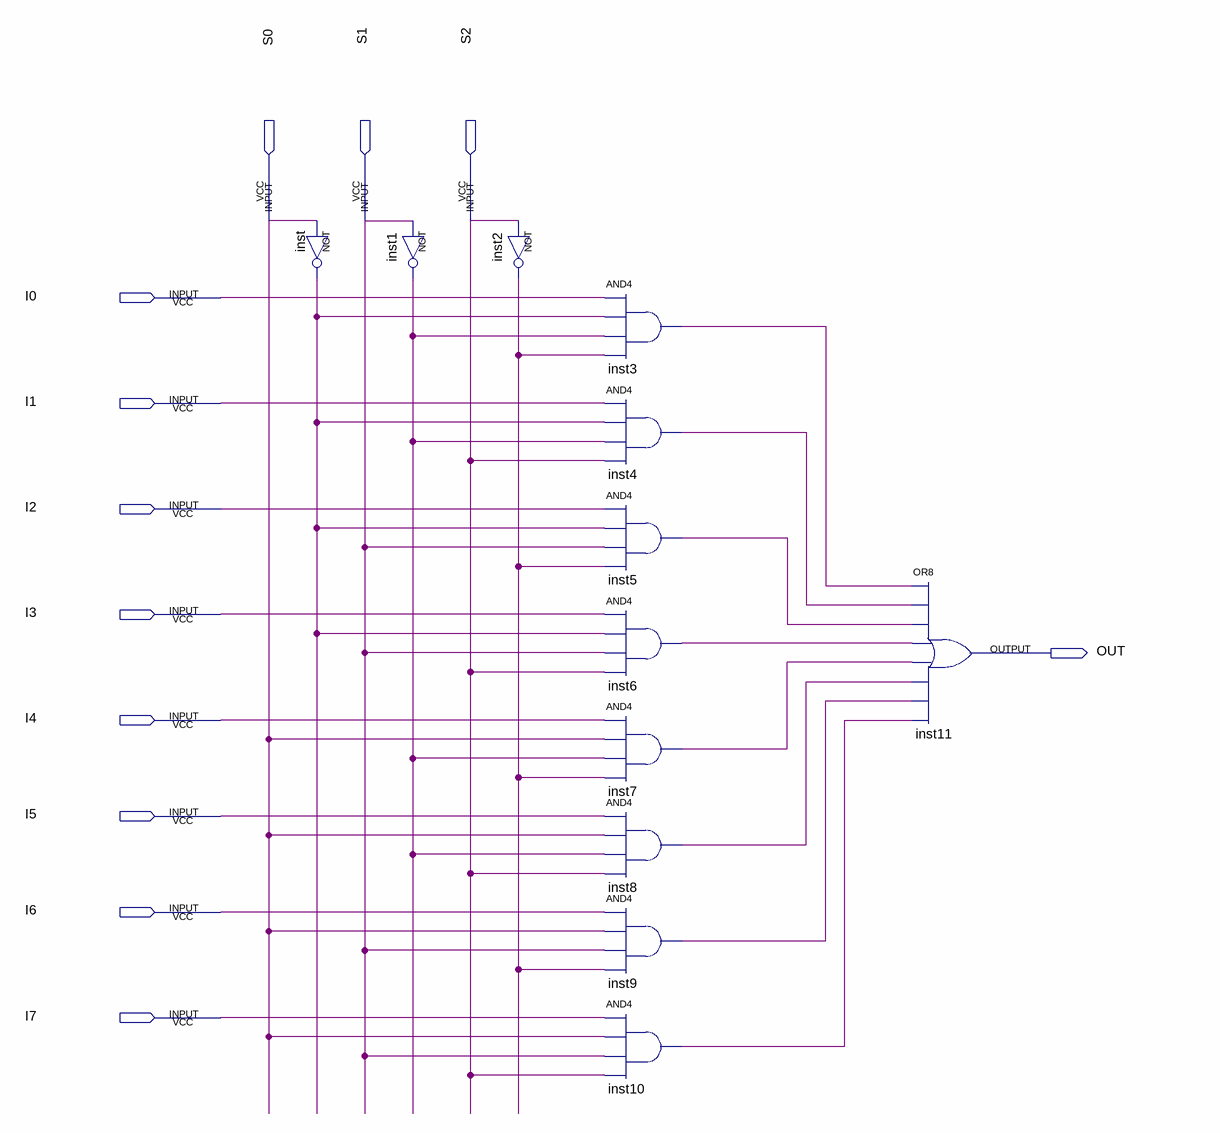
[diagram p0: schematic sheet]
// Quartus schematic MUX8x1.bdf as structural Verilog: 12 symbols, 12 pins
module MUX8x1 (
  input  S0,
  input  S1,
  input  S2,
  input  I0,
  input  I1,
  input  I2,
  input  I3,
  input  I4,
  input  I5,
  input  I6,
  input  I7,
  output OUT
);

  wire inst1_out, inst2_out, inst3_out, inst4_out, inst5_out, inst6_out, inst7_out, inst8_out, inst9_out,
       inst10_out, inst_out;

  not inst (inst_out, S0);
  not inst1 (inst1_out, S1);
  not inst2 (inst2_out, S2);
  and inst3 (inst3_out, I0, inst_out, inst1_out, inst2_out);
  and inst4 (inst4_out, I1, inst_out, inst1_out, S2);
  and inst5 (inst5_out, I2, inst_out, S1, inst2_out);
  and inst6 (inst6_out, I3, inst_out, S1, S2);
  and inst7 (inst7_out, I4, S0, inst1_out, inst2_out);
  and inst8 (inst8_out, I5, S0, inst1_out, S2);
  and inst9 (inst9_out, I6, S0, S1, inst2_out);
  and inst10 (inst10_out, I7, S0, S1, S2);
  or inst11 (OUT, inst3_out, inst4_out, inst5_out, inst6_out, inst7_out, inst8_out, inst9_out, inst10_out);
endmodule
